# Altium schematic sheet Ampli.SchDoc
size 431 x 279 mm; SheetNumber: 1; SheetTotal: 1; ENG_APP_DATE: --/--/--; DSN_APP_DATE: --/--/--; CHK_APP_DATE: --/--/--
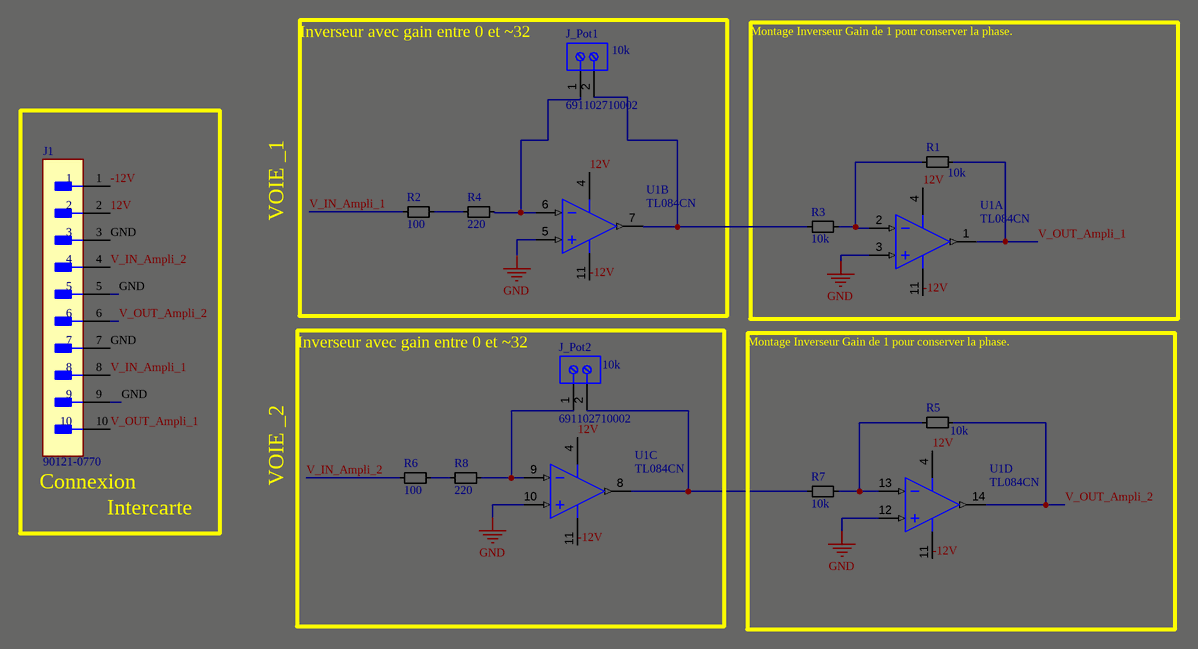
[diagram p0: Ampli.SchDoc]

## Parts
J1  90121-0770  [FP-90121-0770-MFG]
J_Pot1  691102710002  [691102710002]
J_Pot2  691102710002  [691102710002]
R1  value 10k  [Res_Axial_3.5x6.5mm_TH]  (hidden comment: Res_3.5x6.5mm_TH)
R2  value 100  [Res_Axial_3.5x6.5mm_TH]  (hidden comment: Res_3.5x6.5mm_TH)
R3  value 10k  [Res_Axial_3.5x6.5mm_TH]  (hidden comment: Res_3.5x6.5mm_TH)
R4  value 220  [Res_Axial_3.5x6.5mm_TH]  (hidden comment: Res_3.5x6.5mm_TH)
R5  value 10k  [Res_Axial_3.5x6.5mm_TH]  (hidden comment: Res_3.5x6.5mm_TH)
R6  value 100  [Res_Axial_3.5x6.5mm_TH]  (hidden comment: Res_3.5x6.5mm_TH)
R7  value 10k  [Res_Axial_3.5x6.5mm_TH]  (hidden comment: Res_3.5x6.5mm_TH)
R8  value 220  [Res_Axial_3.5x6.5mm_TH]  (hidden comment: Res_3.5x6.5mm_TH)
U1  TL084CN  [N0014A]  (parts A,B,C,D of 4)

## Nets
GND: J1.3 J1.5 J1.7 J1.9 U1.3(IN1+) U1.5(IN2+) U1.10(IN3+) U1.12(IN4+)
12V: J1.2 U1.4(VCC+)
-12V: J1.1 U1.11(VCC-)
V_IN_Ampli_1: J1.8 R2.0
V_IN_Ampli_2: J1.4 R6.0
V_OUT_Ampli_1: J1.10 R1.1 U1.1(OUT1)
V_OUT_Ampli_2: J1.6 R5.1 U1.14(OUT4)
NetJ_Pot1_1: J_Pot1.1 R4.1 U1.6(IN2-)
NetJ_Pot1_2: J_Pot1.2 R3.0 U1.7(OUT2)
NetJ_Pot2_1: J_Pot2.1 R8.1 U1.9(IN3-)
NetJ_Pot2_2: J_Pot2.2 R7.0 U1.8(OUT3)
NetR1_0: R1.0 R3.1 U1.2(IN1-)
NetR2_1: R2.1 R4.0
NetR5_0: R5.0 R7.1 U1.13(IN4-)
NetR6_1: R6.1 R8.0

## Notes on the sheet
- (near J_Pot1) 10k
- VOIE _1
- Inverseur avec gain entre 0 et ~32
- (near J_Pot2) 10k
- Montage Inverseur Gain de 1 pour conserver la phase.
- (near J1) Connexion
- VOIE _2
- Intercarte
- DWG. NO.
- REV.
- SHT.
- THIS DOCUMENT AND THE DATA DISCLOSED HEREIN OR HEREWITH IS THE PROPERTY OF ALTIUM LIMITED AND MAY BE FREELY DISTRIBUTED IN WHOLE. NO RIGHTS ARE RESERVED OR EXPRESS OR IMPLIED WARANTEE GIVEN.
- REVISION
- DESCRIPTION
- DATE
- APPROVED
- ENG:
- APPROVALS
- PROJECT
- DSN:
- CHK:
- REFERENCE DOCUMENTS
- PROJECT REVISION:
- TITLE
- DOCUMENT REVISION:
- DESIGN ITEM:
- BOM:
- FAB DWG:
- PCB DWG:
- ASSY DWG:
- SCALE:
- SIZE
- B
- CAGE CODE
- FILE NAME
- DWG NO.
- SHEET
- OF
- REV

## Library data of the parts
J1 = CMP-04776-001047-1: CONN HEADER R/A 10POS 2.54MM; Voltage Rating: 350V; Current Rating: 3A; Number of Positions: 10; Glow Wire Compliant: Non-compliant; Gender: Male; Number of Circuits: 9; Insulation Resistance: 5GR; Connector Type: Male Pin; Contact Resistance: 20mR; System: Connector; Contact Material: Brass; Voltage Rating (AC): 350V; Housing Material: Polyester; Min Operating Temperature: -55°C; Termination: Solder; Material: Glass; Lead Free: Lead Free; Packaging: Bulk; Pitch: 2.54mm; Mount: Through Hole; Number of Poles: 10; RoHS Compliant: Yes; Working Voltage: 350V; Contact Plating: Gold; Contact Type: Male Pin; Package Quantity: 1; Series: C-Grid III™ 90121; Lead Pitch: 2.54mm; Radiation Hardening: No; Max Operating Temperature: 125°C; Number of Contacts: 10; Housing Color: Black; Orientation: Right Angle; Number of Rows: 1; Color: Black; Contact Mating Length: 0.266inch
J_Pot1 J_Pot2 = CMP-1502-03258-2: NexarPartId: 8917706; Number of Levels: 1; Number of Positions Per Level: 2; Current: 15A; Voltage: 300V; Pitch: 5.0038mm; Plating: Steel; Stripping Length: -6mm; Wire Gauge (Min): 14AWG; Wire Gauge (Max): 22AWG; Length: 7.5mm; Contact Material: Brass; Contact Plating: Tin; Packaging: Box; Number of Pins: 2; Voltage Rating: 300V; Termination: Screw; Number of Contacts: 2; Color: Blue; Current Rating: 15A; Mount: Through Hole; Max Operating Temperature: 105°C; Min Operating Temperature: -40°C; REACH SVHC: Unknown; Height: 13.4mm; Width: 11.2mm; Housing Material: Nylon; RoHS: Compliant; Wire/Cable Gauge: 22AWG; Lead Pitch: 5mm
U1 = CMP-0017-00818-2: JFET-Input Operational Amplifier, 7 to 36 V, 0 to 70 degC, 14-pin DIP (N14), Pb-Free (RoHS); Manufacturer: Texas Instruments; Rating: Catalog; Iq per channel(Max)(mA): 2.8; Number of Channels: 4; IIB(Max)(pA): 400; Vio (25C)(Max)(mV): 15; GBW(Typ)(MHz): 3; Total Supply Voltage(Max)(+5V is 5, +/-5V is 10): 36; Vn at 1kHz(Typ)(nV/rtHz): 18; Sub Family: General Purpose Amplifier, High Supply Voltage Amplifier (>=30V); Slew Rate(Typ)(V/us): 13; Total Supply Voltage(Min)(+5V is 5, +/-5V is 10): 7; CMRR(Min)(dB): 70; ComponentLink3Description: Package Specification; PackageDescription: 14-Pin Plastic In-Line, Body 19.305 x 6.35 mm, Pitch 2.54 mm; ComponentLink1Description: Manufacturer URL; PackageVersion: 4040049/E, 12/2002; Eco-Plan: Pb-Free (RoHS); ComponentLink2URL: http://www.ti.com/lit/ds/symlink/tl084.pdf; ComponentLink1URL: http://www.ti.com/; DatasheetVersion: SLOS081G; Mounting Technology: Through Hole; PartNumber: TL084CN; Offset Drift(Typ)(uV/C): 18; PackageReference: N0014A; ComponentLink3URL: http://www.ti.com/lit/ml/mpdi002c/mpdi002c.pdf; ComponentLink2Description: Datasheet; Code_JEDEC: MS-001